# EAGLE design untitled (EAGLE 9.6.2)
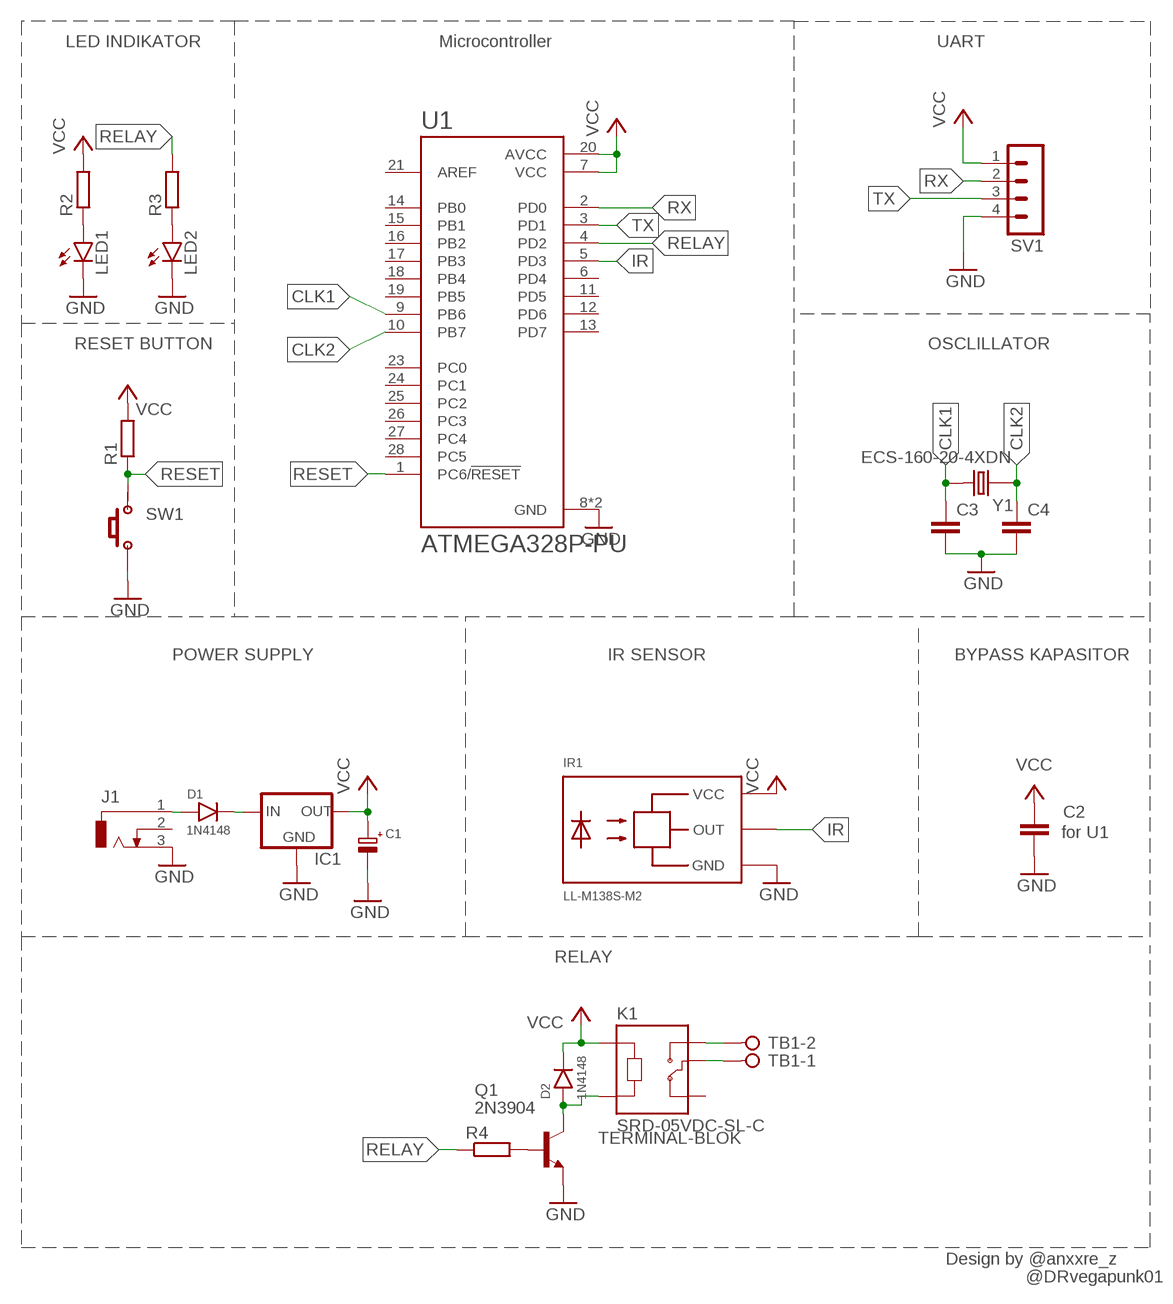
[diagram p0: schematic, sheet 1]

## Parts
C1  CAP-ELCO  [ELCO1]
C2  CAP-NON  [MKM]
C3  C-EU025-025X050  [C025-025X050]
C4  C-EU025-025X050  [C025-025X050]
D1  1N4148  [DIODE]
D2  1N4148  [DIODE]
IC1  78XXS  [78XXS]
IR1  LL-M138S-M2  [LL-M138S-M2]
J1  DCJ0303  [DCJ0303]
K1  SRD-05VDC-SL-C  [RELAY_SRD-05VDC-SL-C]
LED1  LED5MM  [LED5MM]
LED2  LED5MM  [LED5MM]
Q1  2N3904  [TO92-EBC]
R1  RES0207/10  [0207/10]
R2  RES0207/10  [0207/10]
R3  RES0207/10  [0207/10]
R4  RES0207/10  [0207/10]
SV1  MA04-1  [MA04-1]
SW1  PUSH_BUTTON4P  [PUSH_BUTTON_4P]
TB1  TERMINAL-BLOK  [TB-2P]
U1  ATMEGA328P-PU  [DIP794W46P254L2967H457Q28B]
Y1  ECS-160-20-4XDN  [XTAL_ECS-160-20-4XDN]

## Nets
CLK1: C3.1 U1.9(PB6) Y1.2
CLK2: C4.1 U1.10(PB7) Y1.1
GND: C1.2 C2.2 C3.2 C4.2 IC1.GND IR1.GND J1.3 LED1.K(C) LED2.K(C) Q1.E SV1.4 SW1.1 SW1.2 U1.8(GND) U1.22(GND)
IR: IR1.OUT U1.5(PD3)
N$1: D1.1 J1.1
N$2: D1.2 IC1.IN
N$3: LED1.A R2.1
N$4: LED2.A R3.1
N$5: D2.1 K1.A2 Q1.C
N$6: Q1.B R4.2
N$7: K1.NO TB1.2
N$8: K1.COM TB1.1
RELAY: R3.2 R4.1 U1.4(PD2)
RESET: R1.1 SW1.3 SW1.4 U1.1(PC6/!RESET)
RX: SV1.2 U1.2(PD0)
TX: SV1.3 U1.3(PD1)
VCC: C1.1 C2.1 D2.2 IC1.OUT IR1.VCC K1.A1 R1.2 R2.2 SV1.1 U1.7(VCC) U1.20(AVCC)
Unconnected: J1.2 K1.NC U1.6(PD4) U1.11(PD5) U1.12(PD6) U1.13(PD7) U1.14(PB0) U1.15(PB1) U1.16(PB2) U1.17(PB3) U1.18(PB4) U1.19(PB5) U1.21(AREF) U1.23(PC0) U1.24(PC1) U1.25(PC2) U1.26(PC3) U1.27(PC4) U1.28(PC5)

## Notes on the sheet
- LED INDIKATOR | Microcontroller | UART
- RESET BUTTON | OSCLILLATOR
- POWER SUPPLY | IR SENSOR | BYPASS KAPASITOR
- for U1
- RELAY
- Design by @anxxre_z
- @DRvegapunk01

## Library data of the parts
C1 = LKS_NAS_2024_PHD_A2_Library:CAP-ELCO
C2 = LKS_NAS_2024_PHD_A2_Library:CAP-NON
C3 C4 = rcl:C-EU: CAPACITOR, European symbol; SPICEPREFIX: C
D1 D2 = LKS_NAS_2024_PHD_A2_Library:1N4148
IC1 = v-reg:78XXS: VOLTAGE REGULATOR
IR1 = IR Sensor:LL-M138S-M2
J1 = con-jack:DCJ0303: DC POWER JACK Source: DCJ0303.pdf; OC_FARNELL: unknown; OC_NEWARK: unknown
K1 = SRD-05VDC-SL-C:SRD-05VDC-SL-C: 5V Trigger Relay Module For Arduino And Raspberry Pi 5V Trigger Relay Module For Arduino And Raspberry Pi; MANUFACTURER: SONGLE RELAY; STANDARD: IPC-7251
LED1 LED2 = LKS_NAS_2024_PHD_A2_Library:LED: LED OSRAM: - CHIPLED LG R971, LG N971, LY N971, LG Q971, LY Q971, LO R971, LY R971 LH N974, LH R974 LS Q976, LO Q976, LY Q976 LO Q996 - Hyper CHIPLED LW Q18S LB Q993, LB Q99A, LB R99A - SideLED LS A670, LO A670, LY A670, LG A670, LP A670 LB A673, LV A673, LT A673, LW A673 LH A674 LY A675 LS A676, LA A676, LO A676, LY A676, LW A676 LS A679, LY A679, LG A679 - Hyper Micro SIDELED® LS Y876, LA Y876, LO Y876, LY Y876 LT Y87S - SmartLED LW L88C, LW L88S LB L89C, LB L89S, LG L890 LS L89K, LO L89K, LY L89K LS L896, LA L896, LO L896, LY L896 - TOPLED LS T670, LO T670, LY T670, LG T670, LP T670 LSG T670, LSP T670, LSY T670, LOP T670, LYG T670 LG T671, LOG T671, LSG T671 LB T673, LV T673, LT T673, LW T673 LH T674 LS T676, LA T676, LO T676, LY T676, LB T676, LH T676, LSB T676, LW T676 LB T67C, LV T67C, LT T67C, LS T67K, LO T67K, LY T67K, LW E67C LS E67B, LA E67B, LO E67B, LY E67B, LB E67C, LV E67C, LT E67C LW T67C LS T679, LY T679, LG T679 LS T770, LO T770, LY T770, LG T770, LP T770 LB T773, LV T773, LT T773, LW T773 LH T774 LS E675, LA E675, LY E675, LS T675 LS T776, LA T776, LO T776, LY T776, LB T776 LHGB T686 LT T68C, LB T68C - Hyper Mini TOPLED® LB M676 - Mini TOPLED Santana® LG M470 LS M47K, LO M47K, LY M47K Source: http://www.osram.convergy.de LUXEON: - LUMILED® LXK2-PW12-R00, LXK2-PW12-S00, LXK2-PW14-U00, LXK2-PW14-V00 LXK2-PM12-R00, LXK2-PM12-S00, LXK2-PM14-U00 LXK2-PE12-Q00, LXK2-PE12-R00, LXK2-PE12-S00, LXK2-PE14-T00, LXK2-PE14-U00 LXK2-PB12-K00, LXK2-PB12-L00, LXK2-PB12-M00, LXK2-PB14-N00, LXK2-PB14-P00, LXK2-PB14-Q00 LXK2-PR12-L00, LXK2-PR12-M00, LXK2-PR14-Q00, LXK2-PR14-R00 LXK2-PD12-Q00, LXK2-PD12-R00, LXK2-PD12-S00 LXK2-PH12-R00, LXK2-PH12-S00 LXK2-PL12-P00, LXK2-PL12-Q00, LXK2-PL12-R00 Source: www.luxeon.com KINGBRIGHT: KA-3528ASYC Source: www.kingbright.com
Q1 = LKS_NAS_2024_PHD_A2_Library:2N3904: NPN Silicon Epitaxial Planar Transistor Source: SEMTECH ELECTRONICS LTD. ... 2SC3330 .pdf
R1-R4 = LKS_NAS_2024_PHD_A2_Library:RES: RESISTOR, European symbol; SPICEPREFIX: R
SV1 = con-lstb:MA04-1: PIN HEADER; OC_FARNELL: unknown; OC_NEWARK: unknown
SW1 = LKS_NAS_2024_PHD_A2_Library:PUSH_BUTTON
TB1 = LKS_NAS_2024_PHD_A2_Library:TERMINAL-BLOK
U1 = ATMEGA328P-PU:ATMEGA328P-PU: ATmega Series 20 MHz 32 KB Flash 2 KB SRAM 8-Bit Microcontroller - DIP-28; MANUFACTURER: Atmel
Y1 = ECS-160-20-4XDN:ECS-160-20-4XDN: CRYSTAL T/H; MANUFACTURER: ECS Inc.

## Board
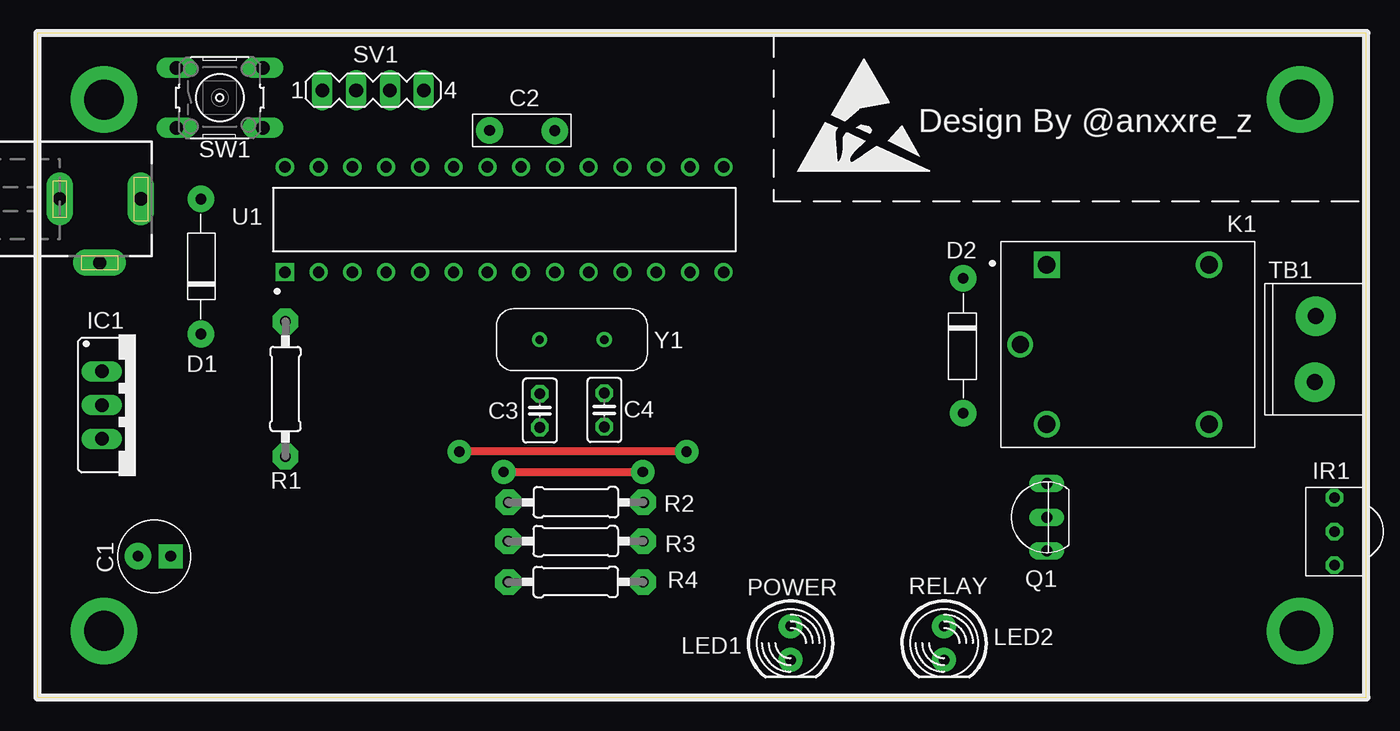
[diagram p1: board, top side]
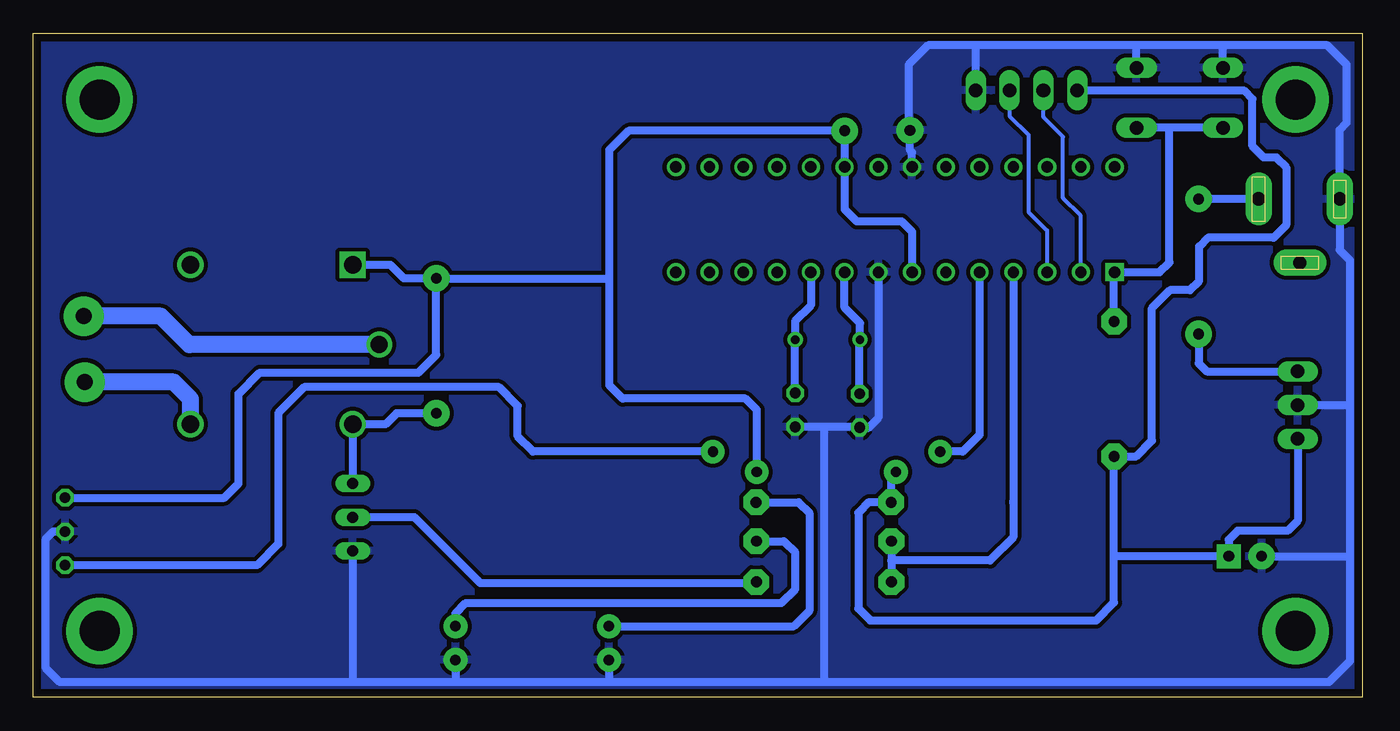
[diagram p2: board, bottom side, seen from below]

Size 100 x 50 mm. Coordinates in mm from the lower left corner, seen from the top.
Outline: 0,0 100,0 100,50 0,50 0,0
Copper layers (1*16): Top 0.035mm / dielectric 1.5mm / Bottom 0.035mm
Design rules "default *": minimum track width 12mil, minimum drill 30mil, track to track 12mil, track to pad 12mil, pad to pad 12mil, via to via 12mil, smd to smd 12mil, copper to edge 24mil, drill to drill 6mil, minimum pad ring 10mil, minimum via ring 8mil, stop-mask expansion 4mil, vias tented up to drill 0mil, thermal gap 12mil

### Footprints (pad centres in the part's own frame; a part is rotated, then mirrored left to right if it is on the bottom)
ELCO1 = drill 0.8 pad 1.8 square: 1 -1.24,0 | drill 0.8 pad 2: 2 1.24,0
MKM = drill 0.8 pad 2: 1 -2.282,-0.019; 2 2.637,-0.047
C025-025X050 = drill 0.813 octagon: 1 -1.27,0; 2 1.27,0
DIODE = drill 0.8 pad 2: 1 -5.064,0.004; 2 5.096,0.004
78XXS = drill 1.016 long: GND 0,-2.54; IN -2.54,-2.54; OUT 2.54,-2.54
LL-M138S-M2 = drill 0.8 octagon: GND 0,0; OUT -2.54,0; VCC 2.54,0
DCJ0303 = drill 1 pad 2 long: 1 0,3.1; 2 4.8,0; 3 0,-3
RELAY_SRD-05VDC-SL-C = drill 1.32 square: A1 -6.1,6 | drill 1.32: A2 -6.1,-6; NC 6.1,6; NO 6.1,-6 | drill 1.29: COM -8.1,0
LED5MM = drill 0.8 pad 1.8: A -1.27,0; K 1.27,0
TO92-EBC = drill 0.813 long: B 0,0; C 2.54,0; E -2.54,0
0207/10 = drill 0.813 pad 1.93 octagon: 1 -5.08,0; 2 5.08,0
MA04-1 = drill 1.016 long: 1 -3.81,0; 2 -1.27,0; 3 1.27,0; 4 3.81,0
PUSH_BUTTON_4P = drill 1.016 long: 1 -3.251,2.261; 2 3.251,2.261; 3 -3.251,-2.261; 4 3.251,-2.261
TB-2P = drill 1.2 pad 3: 1 0.037,2.432; 2 -0.048,-2.533
DIP794W46P254L2967H457Q28B = drill 0.85 square: 1 -3.96,16.51 | drill 0.85: 2 -3.96,13.97; 3 -3.96,11.43; 4 -3.96,8.89; 5 -3.96,6.35; 6 -3.96,3.81; 7 -3.96,1.27; 8 -3.96,-1.27; 9 -3.96,-3.81; 10 -3.96,-6.35; 11 -3.96,-8.89; 12 -3.96,-11.43; 13 -3.96,-13.97; 14 -3.96,-16.51; 15 3.96,-16.51; 16 3.96,-13.97; 17 3.96,-11.43; 18 3.96,-8.89; 19 3.96,-6.35; 20 3.96,-3.81; 21 3.96,-1.27; 22 3.96,1.27; 23 3.96,3.81; 24 3.96,6.35; 25 3.96,8.89; 26 3.96,11.43; 27 3.96,13.97; 28 3.96,16.51
XTAL_ECS-160-20-4XDN = drill 0.63 pad 1.03: 1 -2.44,0; 2 2.44,0

### Placement (x,y rotation side)
C1  8.79,10.63 180 top
C2  36.66,42.64 180 top
C3  37.81,21.59 270 top
C4  42.66,21.64 270 top
D1  12.29,32.45 270 top
D2  69.67,26.45 90 top
IC1  7.38,22 270 top
IR1  97.6,12.49 90 top
J1  4.68,37.52 270 top
K1  82.06,26.56 0 top
LED1  56.68,4.09 270 top
LED2  68.23,4.09 270 top
Q1  75.96,13.56 90 top
R1  18.66,23.22 270 top
R2  40.52,14.69 180 top
R3  40.5,11.76 180 top
R4  40.5,8.69 0 top
SV1  25.25,45.71 0 top
SW1  13.72,45.14 0 top
TB1  96.17,26.26 0 top
U1  35.13,35.97 90 top
U$1  [ESD_10.00]  57.1,39.5 0 top
Y1  40.22,26.93 180 top

### Tracks (layer width: path | path; a pad name or v marks a point on that pad's centre or on a via)
CLK1
  Bottom 0.61: U1.9 38.94,29.34 37.78,28.18 37.78,27.2 | Y1.2 37.78,27.2 | C3.1 37.81,27.17 37.78,27.2
CLK2
  Bottom 0.61: U1.10 41.48,29.51 42.66,28.33 Y1.1 C4.1
GND
  Bottom 0.61: 40.35,1.15 2.5,1.15 0.91,2.74 0.91,10.7 | 40.35,1.15 56.6,1.15 | 56.6,1.15 68.1,1.15 | 68.1,1.15 75.85,1.15 | 75.85,1.15 98,1.15 99.05,2.2 99.05,11.95 98.51,12.49 IR1.GND | 0.91,22.05 0.91,32.91 1.68,33.68 J1.3 1.68,42.72 1.15,43.25 1.15,47.64 2.6,49.09 10.65,49.09 | 0.91,22.05 0.91,10.7 | Q1.E 75.96,1.26 75.85,1.15 | LED2.K 68.23,1.28 68.1,1.15 | LED1.K 56.68,1.23 56.6,1.15 | IC1.GND 0.96,22 0.91,22.05 | 10.65,49.09 16.95,49.09 | 16.95,49.09 28.95,49.09 | 28.95,49.09 32.66,49.09 34.12,47.63 34.12,42.79 C2.2 34.02,41.19 33.86,41.02 U1.22 | SV1.4 29.06,48.98 28.95,49.09 | SW1.2 16.97,49.06 16.95,49.09 | SW1.1 10.47,48.9 10.65,49.09 | U1.8 36.4,21.05 37.2,20.25 37.74,20.25 C3.2 37.86,20.37 40.5,20.37 | 40.5,20.37 C4.2 | 40.5,20.37 40.5,1.3 40.35,1.15 | C1.2 0.98,10.63 0.91,10.7
  pour Bottom: 0,50 100,50 100,0 0,0
IR  (via drill 0.76 pad 1.78)
  Top 0.61: v48.85,18.5 v31.75,18.5
  Bottom 0.61: U1.5 28.78,19.77 30.05,18.5 v31.75,18.5 | IR1.OUT 83.15,9.95 81.55,11.55 81.55,21.4 79.6,23.35 64.95,23.35 63.55,21.95 63.55,19.65 62.4,18.5 v48.85,18.5
N$1
  Bottom 0.61: J1.1 D1.1
N$2
  Bottom 0.61: D1.2 12.29,25.15 11.68,24.54 IC1.IN
N$3
  Bottom 0.61: R2.1 42.4,14.69 41.6,13.89 41.6,6.51 42.75,5.36 LED1.A
N$4
  Bottom 0.61: R3.1 43.51,11.76 42.65,10.9 42.65,8.15 43.7,7.1 67.45,7.1 68.23,6.32 LED2.A
N$5
  Bottom 0.61: Q1.C K1.A2 73.49,20.56 72.66,21.39 D2.1
N$6
  Bottom 0.61: Q1.B 71.31,13.56 66.35,8.6 45.58,8.6 R4.2
N$7
  Bottom 1.27: K1.NO 88.16,22.46 89.43,23.73 TB1.2
N$8
  Bottom 1.27: K1.COM 88.26,26.56 90.4,28.7 96.2,28.7 TB1.1
N$9  (via drill 3 pad 5)
  other vias: 5,45
N$10  (via drill 3 pad 5)
  other vias: 5,5
N$11  (via drill 3 pad 5)
  other vias: 95,5
N$12  (via drill 3 pad 5)
  other vias: 95,45
RELAY
  Bottom 0.61: U1.4 26.24,14.75 26.24,14.65 26.24,12.06 28,10.3 35.42,10.3 | R3.2 35.42,10.3 | 35.42,10.3 R4.1
RESET
  Bottom 0.61: SW1.3 14.5,42.88 | 14.5,42.88 SW1.4 | 14.5,42.88 14.5,32.75 15.24,32.01 U1.1 18.66,31.97 R1.1
RX
  Bottom 0.305: U1.2 21.16,36.26 22.5,37.6 22.5,42.2 23.98,43.68 SV1.2
TX
  Bottom 0.305: SV1.3 26.52,43.77 25.1,42.35 25.1,36.55 23.7,35.15 U1.3
VCC  (via drill 0.76 pad 1.78)
  Top 0.61: v35.08,16.98 v45.55,16.98
  Bottom 0.61: U1.20 C2.1 55.2,42.66 56.65,41.21 56.65,31.35 | D2.2 72.1,31.55 73.11,32.56 K1.A1 | U1.20 | v35.08,16.98 35.44,16.61 R2.2 37.09,14.69 37.1,14.7 37.9,13.9 37.9,6.7 37,5.8 20,5.8 18.66,7.14 18.66,10.7 | SV1.1 8.91,45.71 8.25,45.05 8.25,41.5 7.4,40.65 6.45,40.65 5.7,39.9 5.7,35.55 6.65,34.6 11.6,34.6 12.25,33.95 12.25,31.35 12.95,30.65 14.45,30.65 15.8,29.3 15.8,19.34 17,18.14 R1.2 18.66,10.7 | v45.55,16.98 45.55,21.65 46.4,22.5 55.65,22.5 56.65,23.5 56.65,31.35 | U1.20 38.94,36.75 38.04,35.85 34.65,35.85 33.86,35.06 U1.7 | IR1.VCC 85.62,15.03 84.55,16.1 84.55,22.85 82.95,24.45 71,24.45 69.67,25.78 D2.2 | 56.65,31.35 56.85,31.55 D2.2 | IC1.OUT 4.84,13.3 5.59,12.55 9.35,12.55 10.03,11.87 C1.1 18.59,10.63 18.66,10.7

### Text on the board
tNames: Design By @anxxre_z | POWER | RELAY